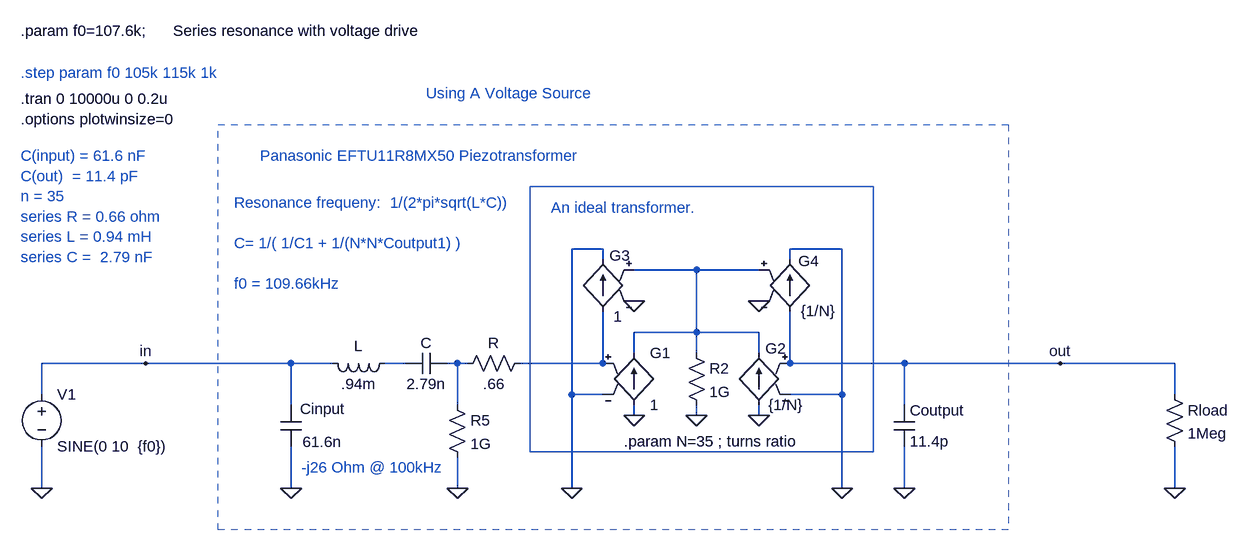
[diagram p0: schematic piezo_electric_transformer_v.asc]
piezo_electric_transformer_v.asc, the LTspice schematic file:
Version 4
SHEET 1 1732 1364
WIRE -704 224 -704 176
WIRE -704 368 -704 304
WIRE -544 176 -704 176
WIRE -320 176 -544 176
WIRE -320 240 -320 176
WIRE -320 368 -320 304
WIRE -256 176 -320 176
WIRE -144 176 -176 176
WIRE -64 176 -80 176
WIRE -64 240 -64 176
WIRE -64 368 -64 320
WIRE -48 176 -64 176
WIRE 112 224 112 0
WIRE 112 368 112 224
WIRE 160 0 112 0
WIRE 160 16 160 0
WIRE 160 176 32 176
WIRE 160 176 160 96
WIRE 160 224 112 224
WIRE 208 160 208 128
WIRE 208 256 208 240
WIRE 304 32 208 32
WIRE 304 128 208 128
WIRE 304 128 304 32
WIRE 304 160 304 128
WIRE 304 256 304 240
WIRE 400 32 304 32
WIRE 400 128 304 128
WIRE 400 160 400 128
WIRE 400 256 400 240
WIRE 448 16 448 0
WIRE 448 176 448 96
WIRE 528 0 448 0
WIRE 528 224 448 224
WIRE 528 224 528 0
WIRE 528 368 528 224
WIRE 624 176 448 176
WIRE 624 240 624 176
WIRE 624 368 624 304
WIRE 864 176 624 176
WIRE 1040 176 864 176
WIRE 1040 224 1040 176
WIRE 1040 368 1040 304
FLAG -704 368 0
FLAG 400 256 0
FLAG 208 256 0
FLAG 208 80 0
FLAG 400 80 0
FLAG 304 256 0
FLAG 112 368 0
FLAG 528 368 0
FLAG 1040 368 0
FLAG -320 368 0
FLAG 624 368 0
FLAG -544 176 in
FLAG 864 176 out
FLAG -64 368 0
SYMBOL voltage -704 208 R0
WINDOW 123 0 0 Left 0
WINDOW 39 0 0 Left 0
SYMATTR InstName V1
SYMATTR Value SINE(0 10  {f0})
SYMBOL res 48 160 R90
WINDOW 0 0 56 VBottom 0
WINDOW 3 32 56 VTop 0
SYMATTR InstName R
SYMATTR Value .66
SYMBOL g 208 144 R0
SYMATTR InstName G1
SYMATTR Value 1
SYMBOL g 400 144 M0
WINDOW 0 -10 9 Right 0
WINDOW 3 -15 96 Right 0
SYMATTR InstName G2
SYMATTR Value {1/N}
SYMBOL g 160 0 M0
WINDOW 0 -10 10 Right 0
WINDOW 3 -16 104 Right 0
SYMATTR InstName G3
SYMATTR Value 1
SYMBOL g 448 0 R0
WINDOW 0 13 18 Left 0
WINDOW 3 17 95 Left 0
SYMATTR InstName G4
SYMATTR Value {1/N}
SYMBOL res 288 144 R0
SYMATTR InstName R2
SYMATTR Value 1G
SYMBOL res 1024 208 R0
SYMATTR InstName Rload
SYMATTR Value 1Meg
SYMBOL cap -336 240 R0
WINDOW 0 30 6 Left 0
WINDOW 3 34 57 Left 0
SYMATTR InstName Cinput
SYMATTR Value 61.6n
SYMBOL cap 608 240 R0
SYMATTR InstName Coutput
SYMATTR Value 11.4p
SYMBOL ind -160 160 R90
WINDOW 0 5 56 VBottom 0
WINDOW 3 32 56 VTop 0
SYMATTR InstName L
SYMATTR Value .94m
SYMBOL cap -80 160 R90
WINDOW 0 0 32 VBottom 0
WINDOW 3 32 32 VTop 0
SYMATTR InstName C
SYMATTR Value 2.79n
SYMBOL res -80 224 R0
SYMATTR InstName R5
SYMATTR Value 1G
TEXT -736 -232 Left 0 !.tran 0 10000u 0 0.2u
TEXT 80 -64 Left 0 ;An ideal transformer.
TEXT 192 296 Left 0 !.param N=35 ; turns ratio
TEXT -736 -144 Left 0 ;C(input) = 61.6 nF\nC(out)  = 11.4 pF\nn = 35\nseries R = 0.66 ohm\nseries L = 0.94 mH\nseries C =  2.79 nF
TEXT -368 -144 Left 0 ;Panasonic EFTU11R8MX50 Piezotransformer
TEXT -736 -200 Left 0 !.options plotwinsize=0
TEXT -736 -272 Left 0 ;.step param f0 105k 115k 1k
TEXT -736 -336 Left 0 !.param f0=107.6k;      Series resonance with voltage drive
TEXT -304 336 Left 0 ;-j26 Ohm @ 100kHz
TEXT -112 -240 Left 0 ;Using A Voltage Source
TEXT -408 -72 Left 0 ;Resonance frequeny:  1/(2*pi*sqrt(L*C))\n \nC= 1/( 1/C1 + 1/(N*N*Coutput1) )\n \nf0 = 109.66kHz
RECTANGLE Normal 576 312 48 -96
RECTANGLE Normal 784 432 -432 -192 1

The netlist it stands for:
* piezo_electric_transformer_v.asc
V1 in 0 SINE(0 10  {f0})
R N003 N002 .66
G1 0 N004 N003 0 1
G2 0 N004 out 0 {1/N}
G3 N003 0 N004 0 1
G4 out 0 N004 0 {1/N}
R2 N004 0 1G
Rload out 0 1Meg
Cinput in 0 61.6n
Coutput out 0 11.4p
L N001 in .94m
C N002 N001 2.79n
R5 N002 0 1G
.tran 0 10000u 0 0.2u
* An ideal transformer.
.param N=35 ; turns ratio
* C(input) = 61.6 nF
* C(out)  = 11.4 pF
* n = 35
* series R = 0.66 ohm
* series L = 0.94 mH
* series C =  2.79 nF
* Panasonic EFTU11R8MX50 Piezotransformer
.options plotwinsize=0
* .step param f0 105k 115k 1k
.param f0=107.6k;      Series resonance with voltage drive
* -j26 Ohm @ 100kHz
* Using A Voltage Source
* Resonance frequeny:  1/(2*pi*sqrt(L*C))
* C= 1/( 1/C1 + 1/(N*N*Coutput1) )
* f0 = 109.66kHz
.backanno
.end